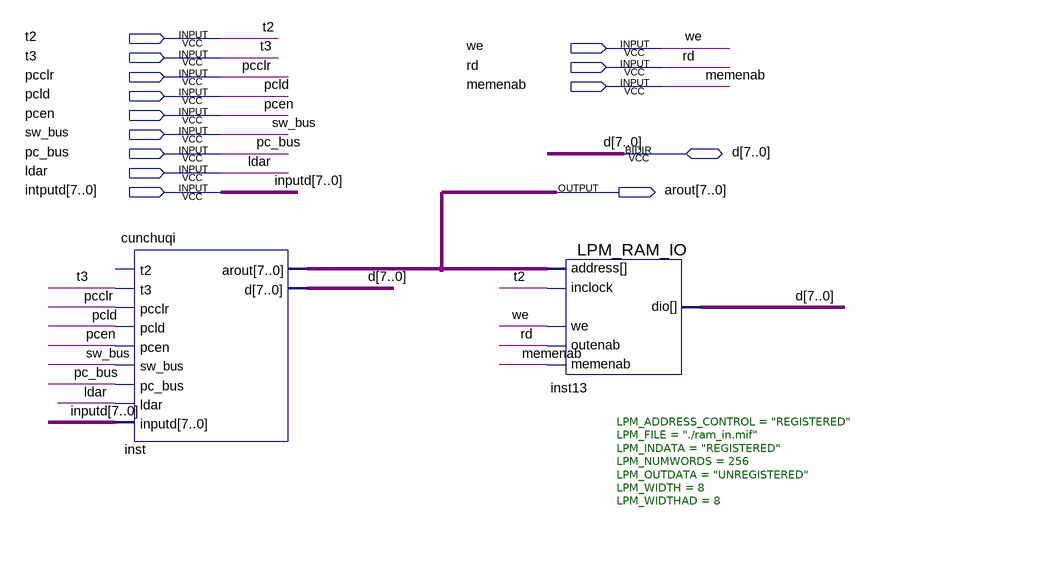
[diagram p0: schematic sheet]
// Quartus schematic Block1.bdf as structural Verilog: 2 symbols, 14 pins
module Block1 (
  input  t2,
  input  we,
  input  t3,
  input  rd,
  input  pcclr,
  input  memenab,
  input  pcld,
  input  pcen,
  input  sw_bus,
  input  pc_bus,
  input  ldar,
  input  [7:0] intputd,
  inout  [7:0] d,
  output [7:0] arout
);

  cunchuqi inst (
    .t3(t3), .pcclr(pcclr), .pcld(pcld), .pcen(pcen), .sw_bus(sw_bus), .pc_bus(pc_bus), .ldar(ldar),
    .inputd(intputd), .arout(arout), .d(d));  // open: t2
  LPM_RAM_IO #(.LPM_ADDRESS_CONTROL("REGISTERED"), .LPM_FILE("./ram_in.mif"), .LPM_INDATA("REGISTERED"), .LPM_NUMWORDS(256), .LPM_OUTDATA("UNREGISTERED"), .LPM_WIDTH(8), .LPM_WIDTHAD(8)) inst13 (
    .address(arout), .memenab(memenab), .inclock(t2), .we(we), .outenab(rd), .dio(d));

  // Other names for the same wires on the sheet: inputd[7:0] = intputd
endmodule
